# EAGLE schematic miniadsb (EAGLE 6.1)
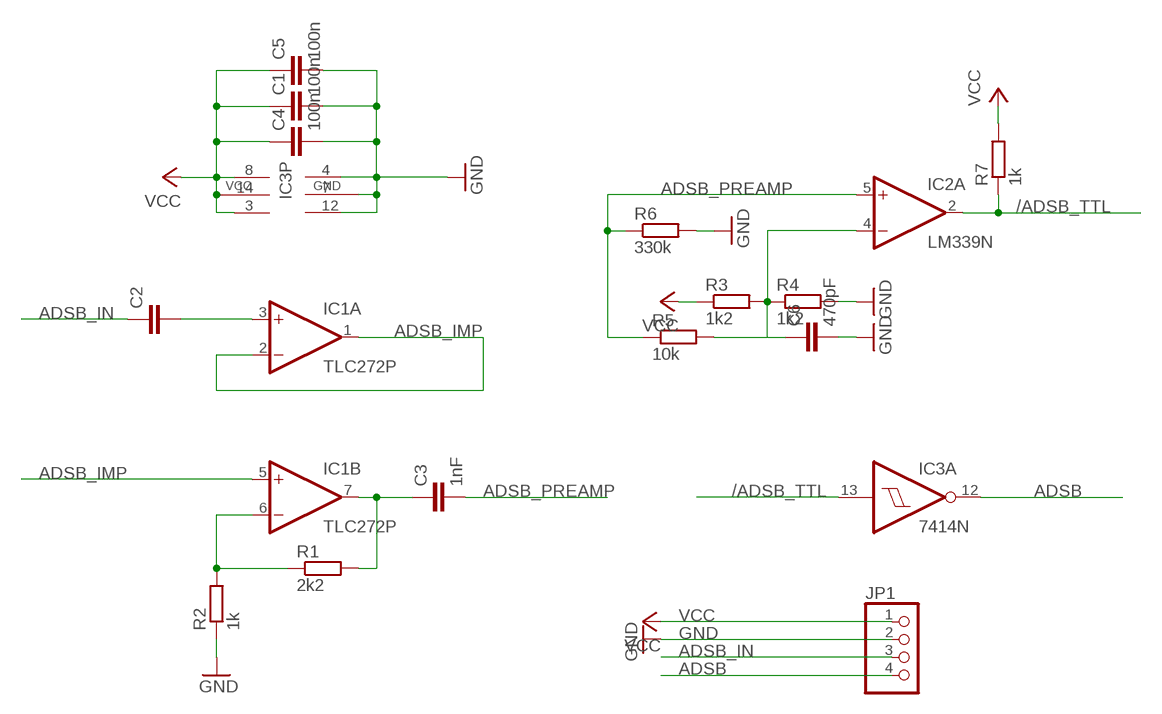
[diagram p0: schematic, sheet 1]

## Parts
C1  100n  C-EUC0805  [C0805]
C2  C-EUC0805  [C0805]
C3  1nF  C-EUC0805  [C0805]
C4  100n  C-EUC0805  [C0805]
C5  100n  C-EUC0805  [C0805]
C6  470pF  C-EUC0805  [C0805]
IC1  TLC272P  [DIL08]
IC2  LM339N  [DIL14]
IC3  7414N  [DIL14]
JP1  PINHD-1X4  [1X04]
R1  2k2  R-EU_R0805  [R0805]
R2  1k  R-EU_R0805  [R0805]
R3  1k2  R-EU_R0805  [R0805]
R4  1k2  R-EU_R0805  [R0805]
R5  10k  R-EU_R0805  [R0805]
R6  330k  R-EU_R0805  [R0805]
R7  1k  R-EU_R0603  [R0603]

## Nets
/ADSB_TTL: IC2.2(A:OUT) IC3.13(A:I) R7.1
ADSB: IC3.12(A:O) JP1.4
ADSB_IMP: IC1.1(A:OUT) IC1.2(A:-IN) IC1.5(B:+IN)
ADSB_IN: C2.1 JP1.3
ADSB_PREAMP: C3.2 IC2.5(A:+IN) R5.1 R6.1
GND: C1.2 C4.2 C5.2 C6.2 IC1.4(P:V-) IC2.12(P:GND) IC3.7(P:GND) JP1.2 R2.1 R4.2 R6.2
N$1: C2.2 IC1.3(A:+IN)
N$2: C3.1 IC1.7(B:OUT) R1.2
N$3: IC1.6(B:-IN) R1.1 R2.2
N$5: C6.1 IC2.4(A:-IN) R3.2 R4.1 R5.2
VCC: C1.1 C4.1 C5.1 IC1.8(P:V+) IC2.3(P:V+) IC3.14(P:VCC) JP1.1 R3.1 R7.2
Unconnected: IC2.1(B:OUT) IC2.6(B:-IN) IC2.7(B:+IN) IC2.8(C:-IN) IC2.9(C:+IN) IC2.10(D:-IN) IC2.11(D:+IN) IC2.13(D:OUT) IC2.14(C:OUT) IC3.1(D:I) IC3.2(D:O) IC3.3(E:I) IC3.4(E:O) IC3.5(F:I) IC3.6(F:O) IC3.8(C:O) IC3.9(C:I) IC3.10(B:O) IC3.11(B:I)

## Library data of the parts
C1-C6 = resistor:C-EU: CAPACITOR, European symbol
IC1 = linear:TLC272: OP AMP
IC2 = linear:LM339: Low Power Low Offset Voltage Quad Comparators with open collector; LM139/LM239/LM339/LM2901/LM3302
IC3 = 74xx-us:74*14: Hex schmitt trigger INVERTER
JP1 = pinhead:PINHD-1X4: PIN HEADER
R1-R6 = resistor:R-EU_: RESISTOR, European symbol
R7 = rcl:R-EU_: RESISTOR, European symbol